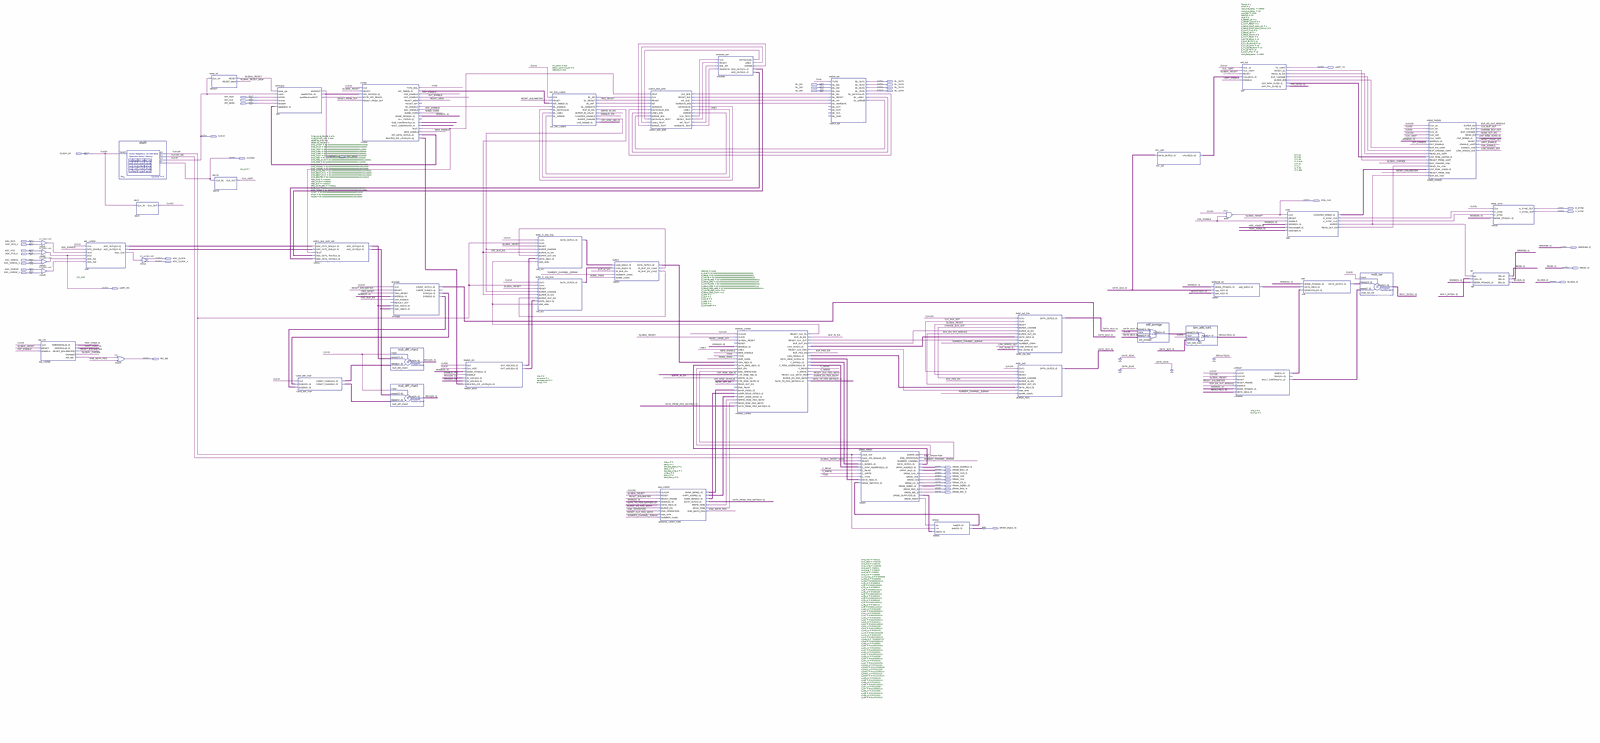
[diagram p0: schematic sheet, whole]
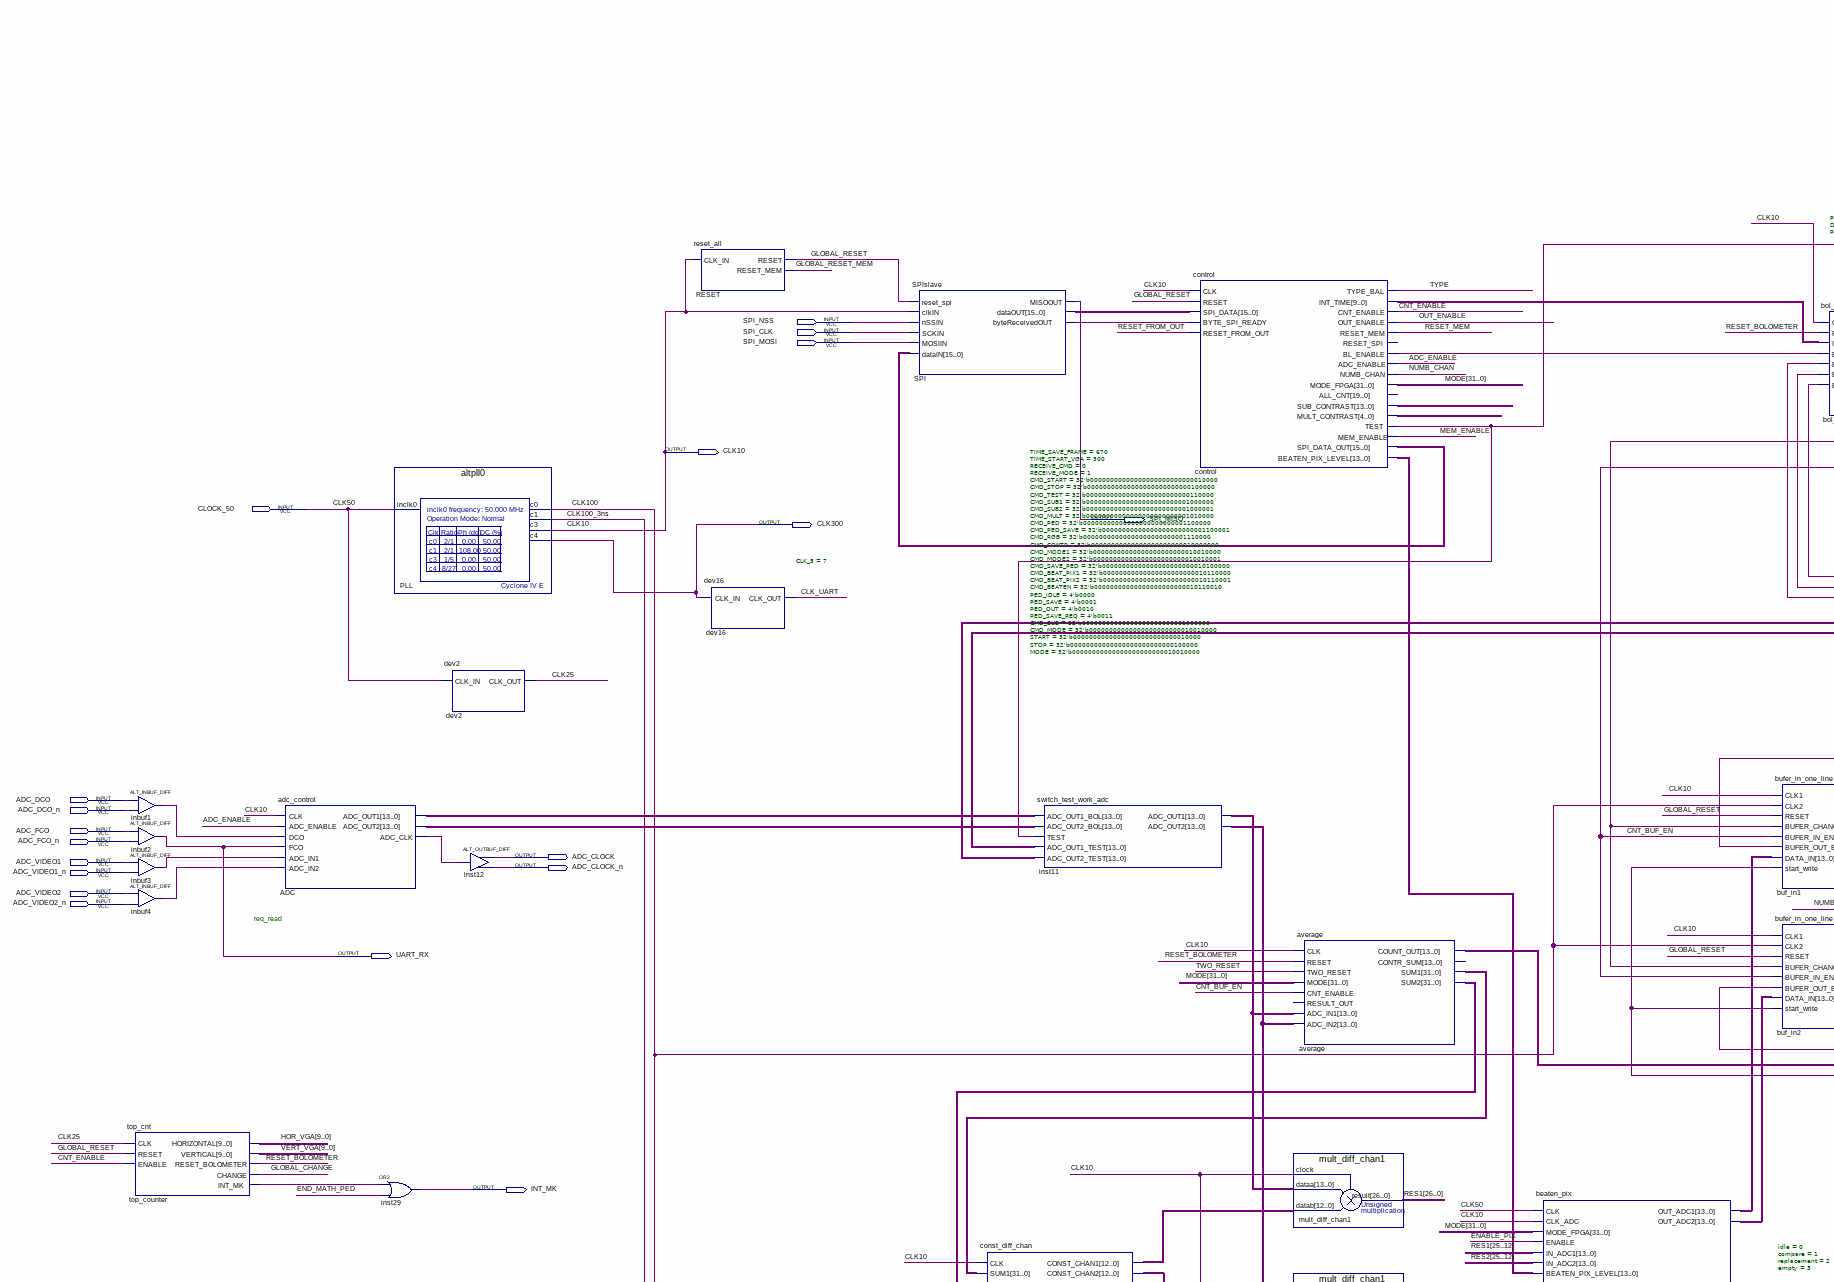
[diagram p1: schematic sheet, upper left part]
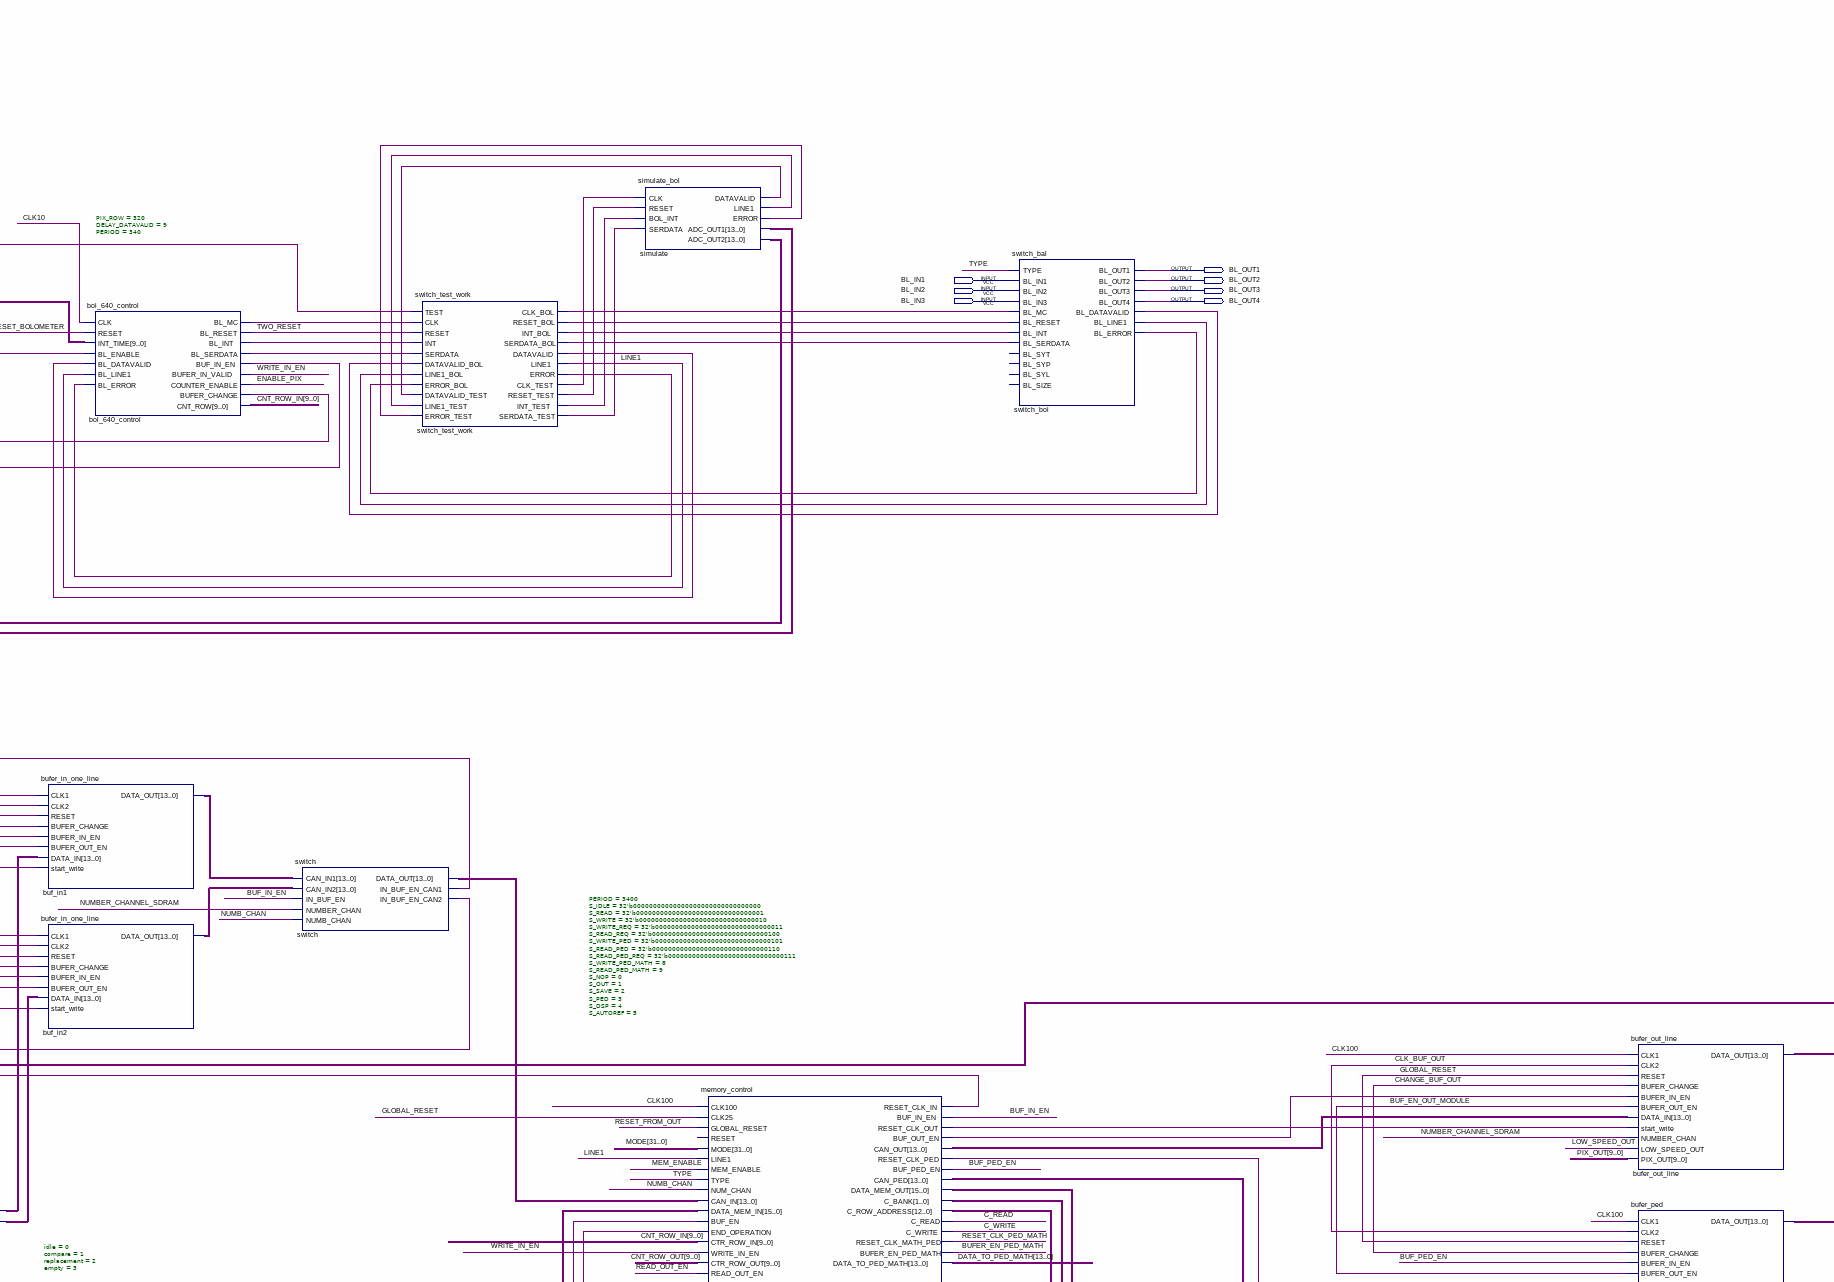
[diagram p2: schematic sheet, upper centre part]
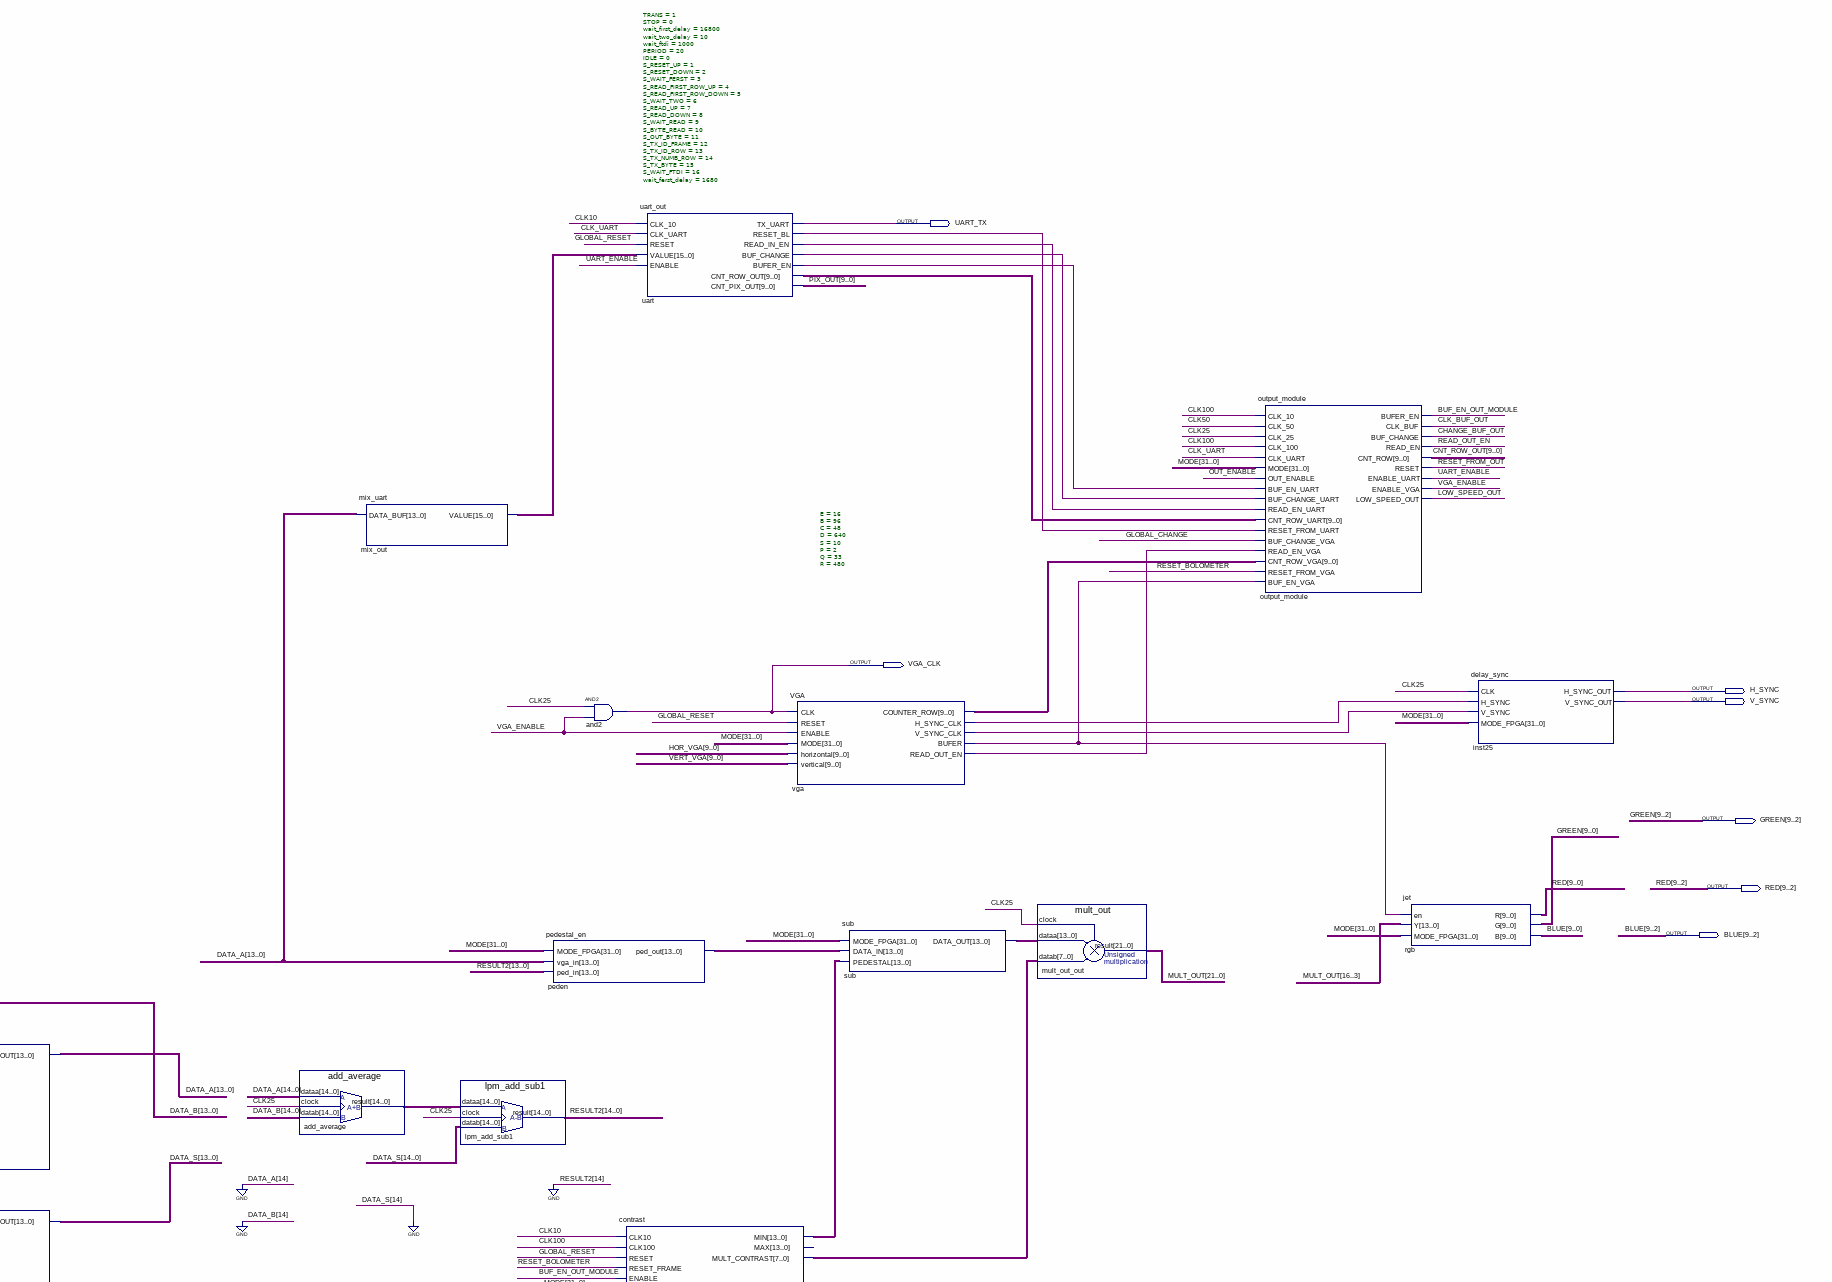
[diagram p3: schematic sheet, upper right part]
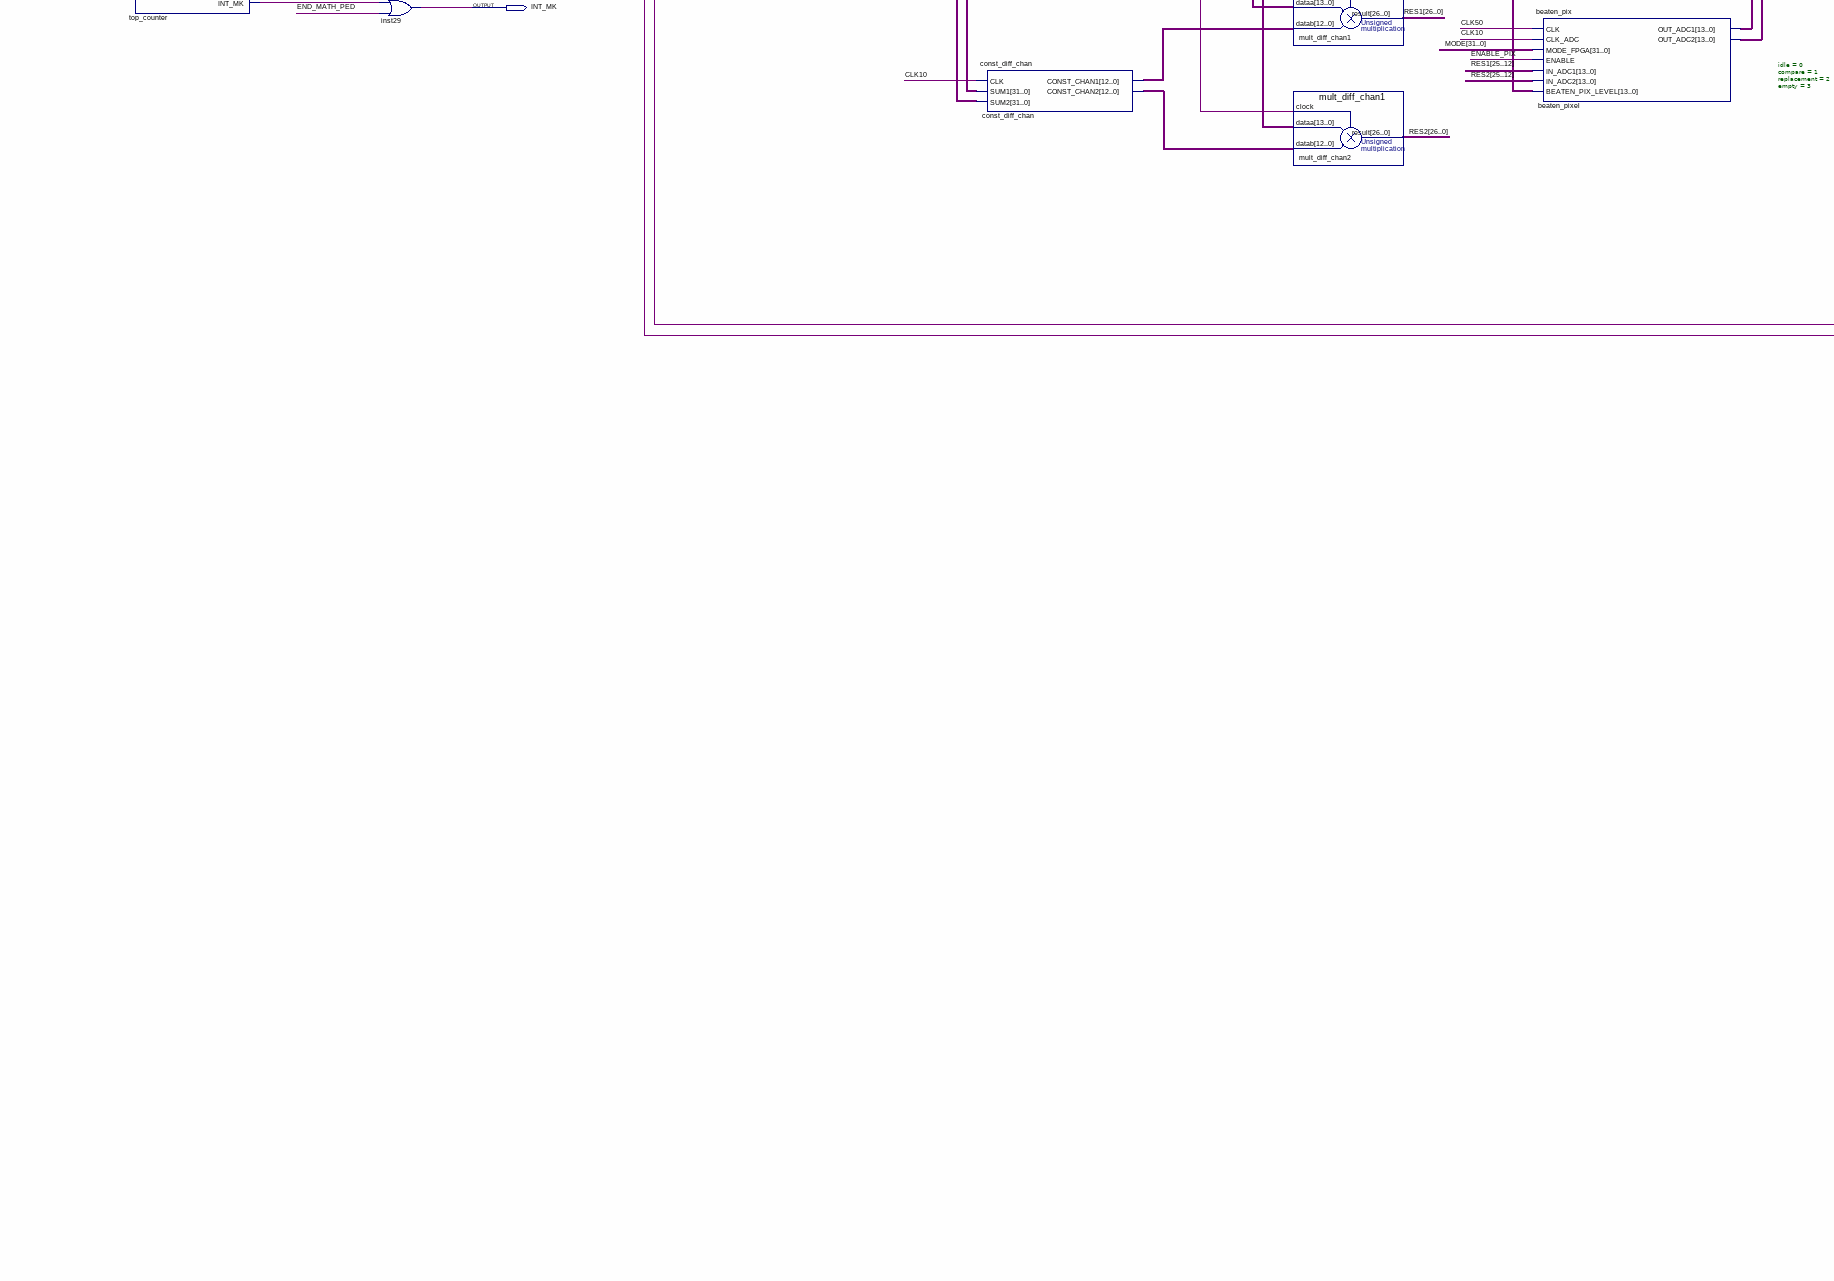
[diagram p4: schematic sheet, lower left part]
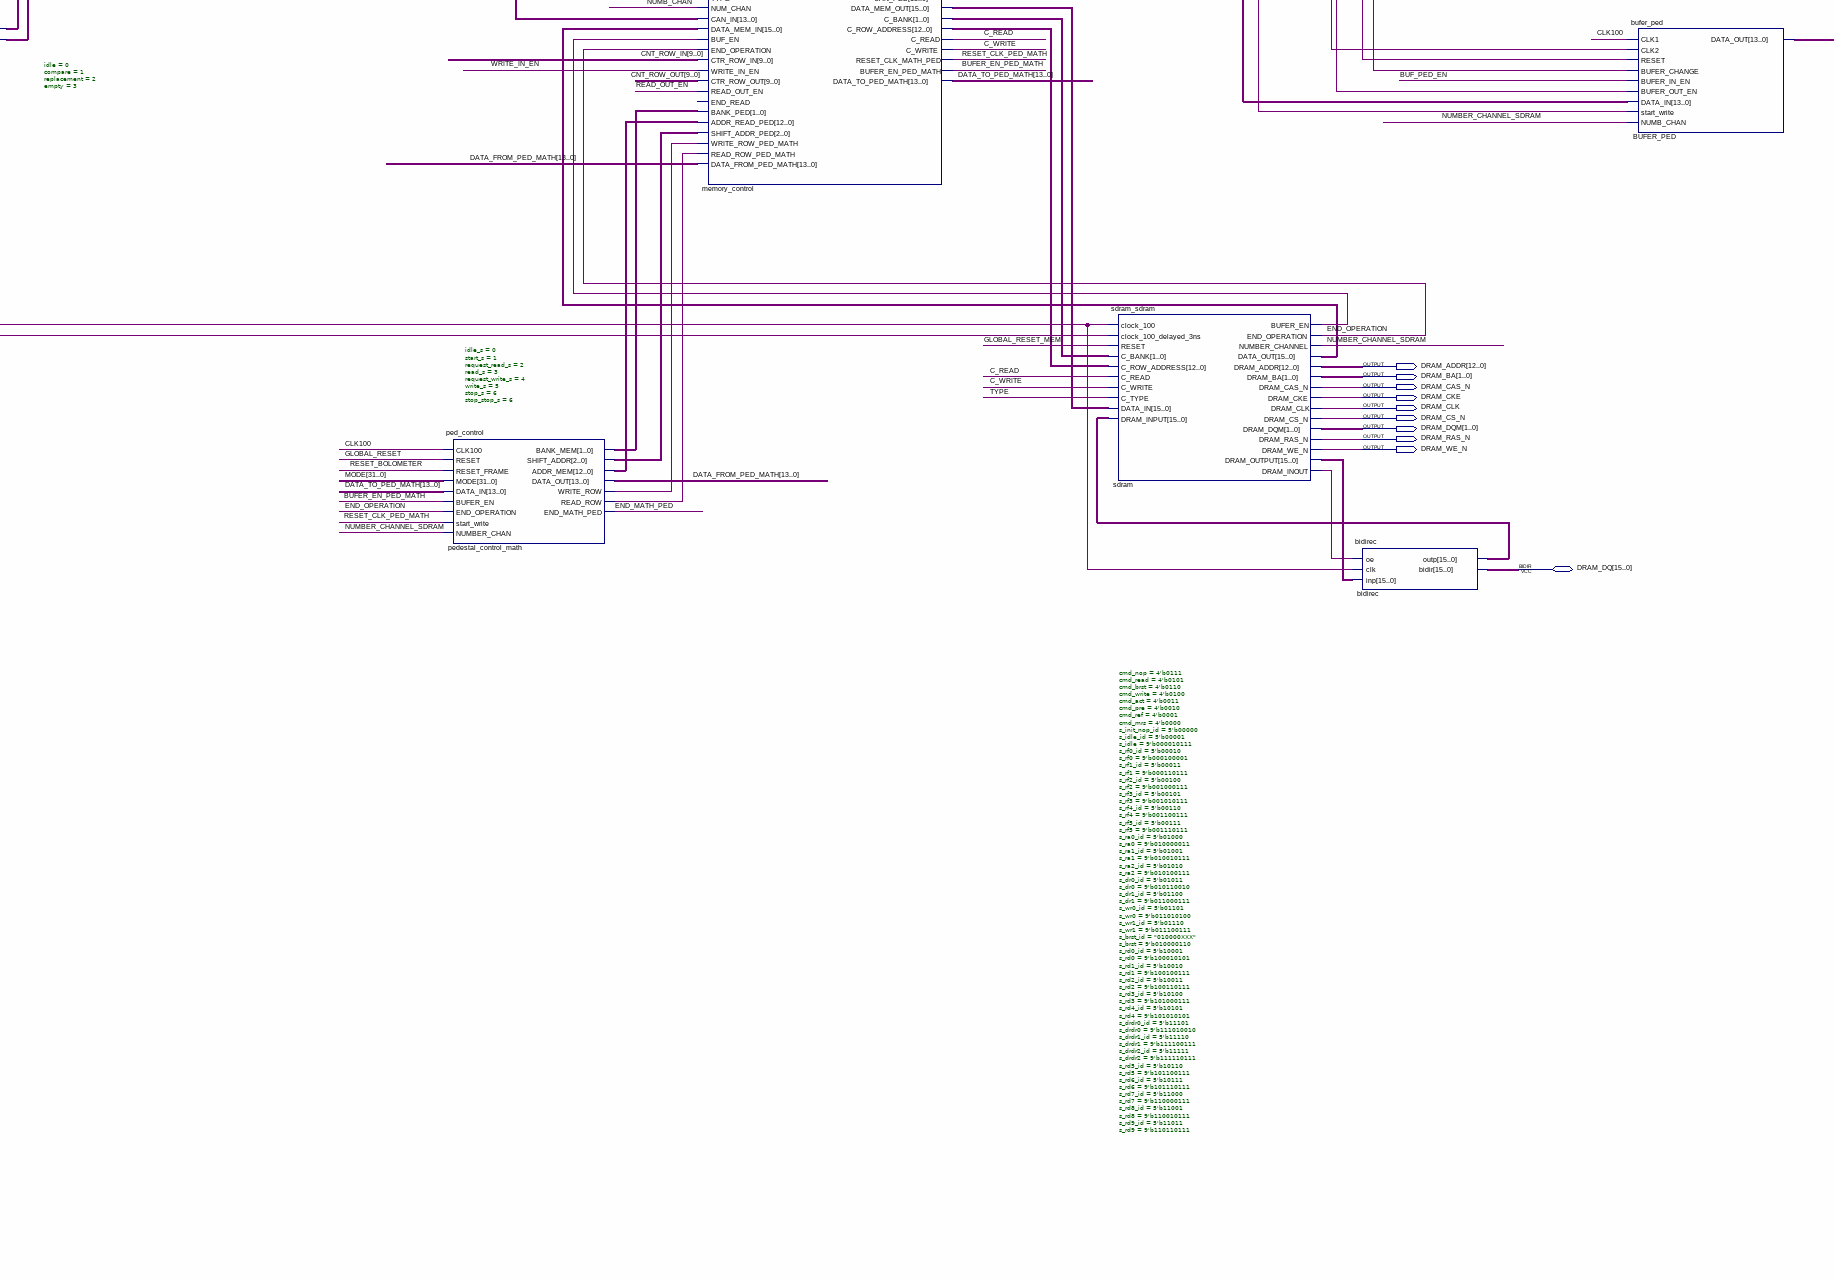
[diagram p5: schematic sheet, lower centre part]
// Quartus schematic Therm_sch.bdf as structural Verilog: 46 symbols, 43 pins
module Therm_sch (
  input  BL_IN1,
  input  BL_IN2,
  input  BL_IN3,
  input  SPI_NSS,
  input  SPI_CLK,
  input  SPI_MOSI,
  input  CLOCK_50,
  input  ADC_DCO,
  input  ADC_DCO_n,
  input  ADC_FCO,
  input  ADC_FCO_n,
  input  ADC_VIDEO1,
  input  ADC_VIDEO1_n,
  input  ADC_VIDEO2,
  input  ADC_VIDEO2_n,
  inout  [15:0] DRAM_DQ,
  output UART_TX,
  output BL_OUT1,
  output BL_OUT2,
  output BL_OUT3,
  output BL_OUT4,
  output CLK10,
  output SPI_MISO,
  output CLK300,
  output VGA_CLK,
  output H_SYNC,
  output V_SYNC,
  output [9:0] GREEN,
  output ADC_CLOCK,
  output ADC_CLOCK_n,
  output [9:0] RED,
  output [9:0] BLUE,
  output UART_RX,
  output INT_MK,
  output [12:0] DRAM_ADDR,
  output [1:0] DRAM_BA,
  output DRAM_CAS_N,
  output DRAM_CKE,
  output DRAM_CLK,
  output DRAM_CS_N,
  output [1:0] DRAM_DQM,
  output DRAM_RAS_N,
  output DRAM_WE_N
);

  wire ADC_adc_clk, ADC_ENABLE, bol_640_control_bl_int, bol_640_control_bl_mc, bol_640_control_bl_serdata,
       bol_640_control_bufer_change, BUF_EN_OUT_MODULE, BUF_IN_EN, BUF_PED_EN, BUFER_EN_PED_MATH, C_READ,
       C_WRITE, CHANGE_BUF_OUT, CLK25, CLK100, CLK100_3ns, CLK_BUF_OUT, CLK_UART, CNT_BUF_EN, CNT_ENABLE,
       control_bl_enable, control_test, ENABLE_PIX, END_MATH_PED, END_OPERATION, GLOBAL_CHANGE, GLOBAL_RESET,
       GLOBAL_RESET_MEM, inbuf1_o, inbuf3_o, inbuf4_o, LINE1, LOW_SPEED_OUT, MEM_ENABLE,
       memory_control_buf_out_en, memory_control_reset_clk_in, memory_control_reset_clk_out,
       memory_control_reset_clk_ped, NUMB_CHAN, NUMBER_CHANNEL_SDRAM, OUT_ENABLE,
       pedestal_control_math_read_row, pedestal_control_math_write_row, READ_OUT_EN, RESET_BOLOMETER,
       RESET_CLK_PED_MATH, RESET_FROM_OUT, RESET_MEM, sdram_bufer_en, sdram_dram_inout, simulate_datavalid,
       simulate_error, simulate_line1, SPI_bytereceivedout, switch_bol_bl_datavalid, switch_bol_bl_error,
       switch_bol_bl_line1, switch_in_buf_en_can1, switch_in_buf_en_can2, switch_test_work_clk_bol,
       switch_test_work_clk_test, switch_test_work_datavalid, switch_test_work_error,
       switch_test_work_int_bol, switch_test_work_int_test, switch_test_work_reset_bol,
       switch_test_work_reset_test, switch_test_work_serdata_bol, switch_test_work_serdata_test,
       top_counter_int_mk, TWO_RESET, TYPE, uart_buf_change, uart_bufer_en, UART_ENABLE, uart_read_in_en,
       uart_reset_bl, vga_bufer, VGA_ENABLE, vga_h_sync_clk, vga_read_out_en, vga_v_sync_clk, WRITE_IN_EN;
  wire [1:0] memory_control_c_bank, pedestal_control_math_bank_mem;
  wire [2:0] pedestal_control_math_shift_addr;
  wire [4:0] control_mult_contrast;
  wire [7:0] contrast_mult_contrast;
  wire [9:0] CNT_ROW_IN, CNT_ROW_OUT, control_int_time, HOR_VGA, PIX_OUT, uart_cnt_row_out, VERT_VGA,
       vga_counter_row;
  wire [12:0] const_diff_chan_const_chan1, const_diff_chan_const_chan2, memory_control_c_row_address,
       pedestal_control_math_addr_mem;
  wire [13:0] ADC_adc_out1, ADC_adc_out2, beaten_pixel_out_adc1, beaten_pixel_out_adc2, buf_in1_data_out,
       buf_in2_data_out, contrast_min, control_beaten_pix_level, control_sub_contrast, DATA_A, DATA_B,
       DATA_FROM_PED_MATH, DATA_S, DATA_TO_PED_MATH, inst11_adc_out1, inst11_adc_out2,
       memory_control_can_out, memory_control_can_ped, peden_ped_out, simulate_adc_out1, simulate_adc_out2,
       sub_data_out, switch_data_out;
  wire [14:0] add_average_result, RESULT2;
  wire [15:0] bidirec_outp, control_spi_data_out, memory_control_data_mem_out, mix_out_value, sdram_data_out,
       sdram_dram_output, SPI_dataout;
  wire [21:0] MULT_OUT;
  wire [26:0] RES1, RES2;
  wire [31:0] average_sum1, average_sum2, MODE;

  ALT_INBUF_DIFF inbuf1 (.i(ADC_DCO), .ibar(ADC_DCO_n), .o(inbuf1_o));
  ALT_INBUF_DIFF inbuf2 (.i(ADC_FCO), .ibar(ADC_FCO_n), .o(UART_RX));
  ALT_INBUF_DIFF inbuf3 (.i(ADC_VIDEO1), .ibar(ADC_VIDEO1_n), .o(inbuf3_o));
  ALT_INBUF_DIFF inbuf4 (.i(ADC_VIDEO2), .ibar(ADC_VIDEO2_n), .o(inbuf4_o));
  top_cnt top_counter (
    .CLK(CLK25), .RESET(GLOBAL_RESET), .ENABLE(CNT_ENABLE), .HORIZONTAL(HOR_VGA), .VERTICAL(VERT_VGA),
    .RESET_BOLOMETER(RESET_BOLOMETER), .CHANGE(GLOBAL_CHANGE), .INT_MK(top_counter_int_mk));
  adc_control ADC (
    .CLK(CLK10), .ADC_ENABLE(ADC_ENABLE), .DCO(inbuf1_o), .FCO(UART_RX), .ADC_IN1(inbuf3_o),
    .ADC_IN2(inbuf4_o), .ADC_OUT1(ADC_adc_out1), .ADC_OUT2(ADC_adc_out2), .ADC_CLK(ADC_adc_clk));
  altpll0 PLL (.inclk0(CLOCK_50), .c0(CLK100), .c1(CLK100_3ns), .c3(CLK10), .c4(CLK300));
  or inst29 (INT_MK, top_counter_int_mk, END_MATH_PED);
  dev2 dev2 (.CLK_IN(CLOCK_50), .CLK_OUT(CLK25));
  ALT_OUTBUF_DIFF inst12 (.i(ADC_adc_clk), .obar(ADC_CLOCK_n), .o(ADC_CLOCK));
  reset_all RESET (.CLK_IN(CLK10), .RESET(GLOBAL_RESET), .RESET_MEM(GLOBAL_RESET_MEM));
  dev16 #(.CLK_5(7)) dev16 (.CLK_IN(CLK300), .CLK_OUT(CLK_UART));
  SPIslave SPI (
    .reset_spi(GLOBAL_RESET), .clkIN(CLK10), .nSSIN(SPI_NSS), .SCKIN(SPI_CLK), .MOSIIN(SPI_MOSI),
    .dataIN(control_spi_data_out), .MISOOUT(SPI_MISO), .dataOUT(SPI_dataout),
    .byteReceivedOUT(SPI_bytereceivedout));
  const_diff_chan const_diff_chan (
    .CLK(CLK10), .SUM1(average_sum1), .SUM2(average_sum2), .CONST_CHAN1(const_diff_chan_const_chan1),
    .CONST_CHAN2(const_diff_chan_const_chan2));
  switch_test_work_adc inst11 (
    .ADC_OUT1_BOL(ADC_adc_out1), .ADC_OUT2_BOL(ADC_adc_out2), .TEST(control_test),
    .ADC_OUT1_TEST(simulate_adc_out1), .ADC_OUT2_TEST(simulate_adc_out2), .ADC_OUT1(inst11_adc_out1),
    .ADC_OUT2(inst11_adc_out2));
  control #(.TIME_SAVE_FRAME(670), .TIME_START_VGA(300), .RECEIVE_CMD(0), .RECEIVE_MODE(1), .CMD_START(32'b00000000000000000000000000010000), .CMD_STOP(32'b00000000000000000000000000100000), .CMD_TEST(32'b00000000000000000000000000110000), .CMD_SUB1(32'b00000000000000000000000001000000), .CMD_SUB2(32'b00000000000000000000000001000001), .CMD_MULT(32'b00000000000000000000000001010000), .CMD_PED(32'b00000000000000000000000001100000), .CMD_PED_SAVE(32'b00000000000000000000000001100001), .CMD_RGB(32'b00000000000000000000000001110000), .CMD_CONTR(32'b00000000000000000000000010000000), .CMD_MODE1(32'b00000000000000000000000010010000), .CMD_MODE2(32'b00000000000000000000000010010001), .CMD_SAVE_PED(32'b00000000000000000000000010100000), .CMD_BEAT_PIX1(32'b00000000000000000000000010110000), .CMD_BEAT_PIX2(32'b00000000000000000000000010110001), .CMD_BEATEN(32'b00000000000000000000000010110010), .PED_IDLE(4'b0000), .PED_SAVE(4'b0001), .PED_OUT(4'b0010), .PED_SAVE_REQ(4'b0011), .CMD_SUB(32'b00000000000000000000000001000000), .CMD_MODE(32'b00000000000000000000000010010000), .START(32'b00000000000000000000000000010000), .STOP(32'b00000000000000000000000000100000), .MODE(32'b00000000000000000000000010010000)) control (
    .CLK(CLK10), .RESET(GLOBAL_RESET), .SPI_DATA(SPI_dataout), .BYTE_SPI_READY(SPI_bytereceivedout),
    .RESET_FROM_OUT(RESET_FROM_OUT), .TYPE_BAL(TYPE), .INT_TIME(control_int_time), .CNT_ENABLE(CNT_ENABLE),
    .OUT_ENABLE(OUT_ENABLE), .RESET_MEM(RESET_MEM), .BL_ENABLE(control_bl_enable), .ADC_ENABLE(ADC_ENABLE),
    .NUMB_CHAN(NUMB_CHAN), .MODE_FPGA(MODE), .SUB_CONTRAST(control_sub_contrast),
    .MULT_CONTRAST(control_mult_contrast), .TEST(control_test), .MEM_ENABLE(MEM_ENABLE),
    .SPI_DATA_OUT(control_spi_data_out), .BEATEN_PIX_LEVEL(control_beaten_pix_level));  // open: RESET_SPI, ALL_CNT
  average average (
    .CLK(CLK10), .RESET(RESET_BOLOMETER), .TWO_RESET(TWO_RESET), .MODE(MODE), .CNT_ENABLE(CNT_BUF_EN),
    .ADC_IN1(inst11_adc_out1), .ADC_IN2(inst11_adc_out2), .COUNT_OUT(DATA_B), .SUM1(average_sum1),
    .SUM2(average_sum2));  // open: RESULT_OUT, CONTR_SUM
  mult_diff_chan1 mult_diff_chan1 (
    .clock(CLK10), .dataa(inst11_adc_out1), .datab(const_diff_chan_const_chan1), .result(RES1));
  mult_diff_chan1 mult_diff_chan2 (
    .clock(CLK10), .dataa(inst11_adc_out2), .datab(const_diff_chan_const_chan2), .result(RES2));
  beaten_pix #(.idle(0), .compare(1), .replacement(2), .empty(3)) beaten_pixel (
    .CLK(CLOCK_50), .CLK_ADC(CLK10), .MODE_FPGA(MODE), .ENABLE(ENABLE_PIX), .IN_ADC1(RES1[25:12]),
    .IN_ADC2(RES2[25:12]), .BEATEN_PIX_LEVEL(control_beaten_pix_level), .OUT_ADC1(beaten_pixel_out_adc1),
    .OUT_ADC2(beaten_pixel_out_adc2));
  bufer_in_one_line buf_in1 (
    .CLK1(CLK10), .CLK2(CLK100), .RESET(GLOBAL_RESET), .BUFER_CHANGE(bol_640_control_bufer_change),
    .BUFER_IN_EN(CNT_BUF_EN), .BUFER_OUT_EN(switch_in_buf_en_can1), .DATA_IN(beaten_pixel_out_adc1),
    .start_write(memory_control_reset_clk_in), .DATA_OUT(buf_in1_data_out));
  bufer_in_one_line buf_in2 (
    .CLK1(CLK10), .CLK2(CLK100), .RESET(GLOBAL_RESET), .BUFER_CHANGE(bol_640_control_bufer_change),
    .BUFER_IN_EN(CNT_BUF_EN), .BUFER_OUT_EN(switch_in_buf_en_can2), .DATA_IN(beaten_pixel_out_adc2),
    .start_write(memory_control_reset_clk_in), .DATA_OUT(buf_in2_data_out));
  bol_640_control #(.PIX_ROW(320), .DELAY_DATAVALID(9), .PERIOD(340)) bol_640_control (
    .CLK(CLK10), .RESET(RESET_BOLOMETER), .INT_TIME(control_int_time), .BL_ENABLE(control_bl_enable),
    .BL_DATAVALID(switch_test_work_datavalid), .BL_LINE1(LINE1), .BL_ERROR(switch_test_work_error),
    .BL_MC(bol_640_control_bl_mc), .BL_RESET(TWO_RESET), .BL_INT(bol_640_control_bl_int),
    .BL_SERDATA(bol_640_control_bl_serdata), .BUF_IN_EN(CNT_BUF_EN), .BUFER_IN_VALID(WRITE_IN_EN),
    .COUNTER_ENABLE(ENABLE_PIX), .BUFER_CHANGE(bol_640_control_bufer_change), .CNT_ROW(CNT_ROW_IN));
  switch switch (
    .CAN_IN1(buf_in1_data_out), .CAN_IN2(buf_in2_data_out), .IN_BUF_EN(BUF_IN_EN),
    .NUMBER_CHAN(NUMBER_CHANNEL_SDRAM), .NUMB_CHAN(NUMB_CHAN), .DATA_OUT(switch_data_out),
    .IN_BUF_EN_CAN1(switch_in_buf_en_can1), .IN_BUF_EN_CAN2(switch_in_buf_en_can2));
  switch_test_work switch_test_work (
    .TEST(control_test), .CLK(bol_640_control_bl_mc), .RESET(TWO_RESET), .INT(bol_640_control_bl_int),
    .SERDATA(bol_640_control_bl_serdata), .DATAVALID_BOL(switch_bol_bl_datavalid),
    .LINE1_BOL(switch_bol_bl_line1), .ERROR_BOL(switch_bol_bl_error), .DATAVALID_TEST(simulate_datavalid),
    .LINE1_TEST(simulate_line1), .ERROR_TEST(simulate_error), .CLK_BOL(switch_test_work_clk_bol),
    .RESET_BOL(switch_test_work_reset_bol), .INT_BOL(switch_test_work_int_bol),
    .SERDATA_BOL(switch_test_work_serdata_bol), .DATAVALID(switch_test_work_datavalid), .LINE1(LINE1),
    .ERROR(switch_test_work_error), .CLK_TEST(switch_test_work_clk_test),
    .RESET_TEST(switch_test_work_reset_test), .INT_TEST(switch_test_work_int_test),
    .SERDATA_TEST(switch_test_work_serdata_test));
  ped_control #(.idle_s(0), .start_s(1), .request_read_s(2), .read_s(3), .request_write_s(4), .write_s(5), .stop_s(6), .stop_stop_s(6)) pedestal_control_math (
    .CLK100(CLK100), .RESET(GLOBAL_RESET), .RESET_FRAME(RESET_BOLOMETER), .MODE(MODE),
    .DATA_IN(DATA_TO_PED_MATH), .BUFER_EN(BUFER_EN_PED_MATH), .END_OPERATION(END_OPERATION),
    .start_write(RESET_CLK_PED_MATH), .NUMBER_CHAN(NUMBER_CHANNEL_SDRAM),
    .BANK_MEM(pedestal_control_math_bank_mem), .SHIFT_ADDR(pedestal_control_math_shift_addr),
    .ADDR_MEM(pedestal_control_math_addr_mem), .DATA_OUT(DATA_FROM_PED_MATH),
    .WRITE_ROW(pedestal_control_math_write_row), .READ_ROW(pedestal_control_math_read_row),
    .END_MATH_PED(END_MATH_PED));
  simulate_bol simulate (
    .CLK(switch_test_work_clk_test), .RESET(switch_test_work_reset_test),
    .BOL_INT(switch_test_work_int_test), .SERDATA(switch_test_work_serdata_test),
    .DATAVALID(simulate_datavalid), .LINE1(simulate_line1), .ERROR(simulate_error),
    .ADC_OUT1(simulate_adc_out1), .ADC_OUT2(simulate_adc_out2));
  memory_control #(.PERIOD(3400), .S_IDLE(32'b00000000000000000000000000000000), .S_READ(32'b00000000000000000000000000000001), .S_WRITE(32'b00000000000000000000000000000010), .S_WRITE_REQ(32'b00000000000000000000000000000011), .S_READ_REQ(32'b00000000000000000000000000000100), .S_WRITE_PED(32'b00000000000000000000000000000101), .S_READ_PED(32'b00000000000000000000000000000110), .S_READ_PED_REQ(32'b00000000000000000000000000000111), .S_WRITE_PED_MATH(8), .S_READ_PED_MATH(9), .S_NOP(0), .S_OUT(1), .S_SAVE(2), .S_PED(3), .S_DSP(4), .S_AUTOREF(5)) memory_control (
    .CLK100(CLK100), .CLK25(GLOBAL_RESET), .GLOBAL_RESET(RESET_FROM_OUT), .MODE(MODE), .LINE1(LINE1),
    .MEM_ENABLE(MEM_ENABLE), .TYPE(TYPE), .NUM_CHAN(NUMB_CHAN), .CAN_IN(switch_data_out),
    .DATA_MEM_IN(sdram_data_out), .BUF_EN(sdram_bufer_en), .END_OPERATION(END_OPERATION),
    .CTR_ROW_IN(CNT_ROW_IN), .WRITE_IN_EN(WRITE_IN_EN), .CTR_ROW_OUT(CNT_ROW_OUT), .READ_OUT_EN(READ_OUT_EN),
    .BANK_PED(pedestal_control_math_bank_mem), .ADDR_READ_PED(pedestal_control_math_addr_mem),
    .SHIFT_ADDR_PED(pedestal_control_math_shift_addr), .WRITE_ROW_PED_MATH(pedestal_control_math_write_row),
    .READ_ROW_PED_MATH(pedestal_control_math_read_row), .DATA_FROM_PED_MATH(DATA_FROM_PED_MATH),
    .RESET_CLK_IN(memory_control_reset_clk_in), .BUF_IN_EN(BUF_IN_EN),
    .RESET_CLK_OUT(memory_control_reset_clk_out), .BUF_OUT_EN(memory_control_buf_out_en),
    .CAN_OUT(memory_control_can_out), .RESET_CLK_PED(memory_control_reset_clk_ped), .BUF_PED_EN(BUF_PED_EN),
    .CAN_PED(memory_control_can_ped), .DATA_MEM_OUT(memory_control_data_mem_out),
    .C_BANK(memory_control_c_bank), .C_ROW_ADDRESS(memory_control_c_row_address), .C_READ(C_READ),
    .C_WRITE(C_WRITE), .RESET_CLK_MATH_PED(RESET_CLK_PED_MATH), .BUFER_EN_PED_MATH(BUFER_EN_PED_MATH),
    .DATA_TO_PED_MATH(DATA_TO_PED_MATH));  // open: RESET, END_READ
  switch_bal switch_bol (
    .TYPE(TYPE), .BL_IN1(BL_IN1), .BL_IN2(BL_IN2), .BL_IN3(BL_IN3), .BL_MC(switch_test_work_clk_bol),
    .BL_RESET(switch_test_work_reset_bol), .BL_INT(switch_test_work_int_bol),
    .BL_SERDATA(switch_test_work_serdata_bol), .BL_OUT1(BL_OUT1), .BL_OUT2(BL_OUT2), .BL_OUT3(BL_OUT3),
    .BL_OUT4(BL_OUT4), .BL_DATAVALID(switch_bol_bl_datavalid), .BL_LINE1(switch_bol_bl_line1),
    .BL_ERROR(switch_bol_bl_error));  // open: BL_SYT, BL_SYP, BL_SYL, BL_SIZE
  sdram_sdram #(.cmd_nop(4'b0111), .cmd_read(4'b0101), .cmd_brst(4'b0110), .cmd_write(4'b0100), .cmd_act(4'b0011), .cmd_pre(4'b0010), .cmd_ref(4'b0001), .cmd_mrs(4'b0000), .s_init_nop_id(5'b00000), .s_idle_id(5'b00001), .s_idle(9'b000010111), .s_rf0_id(5'b00010), .s_rf0(9'b000100001), .s_rf1_id(5'b00011), .s_rf1(9'b000110111), .s_rf2_id(5'b00100), .s_rf2(9'b001000111), .s_rf3_id(5'b00101), .s_rf3(9'b001010111), .s_rf4_id(5'b00110), .s_rf4(9'b001100111), .s_rf5_id(5'b00111), .s_rf5(9'b001110111), .s_ra0_id(5'b01000), .s_ra0(9'b010000011), .s_ra1_id(5'b01001), .s_ra1(9'b010010111), .s_ra2_id(5'b01010), .s_ra2(9'b010100111), .s_dr0_id(5'b01011), .s_dr0(9'b010110010), .s_dr1_id(5'b01100), .s_dr1(9'b011000111), .s_wr0_id(5'b01101), .s_wr0(9'b011010100), .s_wr1_id(5'b01110), .s_wr1(9'b011100111), .s_brst_id("010000XXX"), .s_brst(9'b010000110), .s_rd0_id(5'b10001), .s_rd0(9'b100010101), .s_rd1_id(5'b10010), .s_rd1(9'b100100111), .s_rd2_id(5'b10011), .s_rd2(9'b100110111), .s_rd3_id(5'b10100), .s_rd3(9'b101000111), .s_rd4_id(5'b10101), .s_rd4(9'b101010101), .s_drdr0_id(5'b11101), .s_drdr0(9'b111010010), .s_drdr1_id(5'b11110), .s_drdr1(9'b111100111), .s_drdr2_id(5'b11111), .s_drdr2(9'b111110111), .s_rd5_id(5'b10110), .s_rd5(9'b101100111), .s_rd6_id(5'b10111), .s_rd6(9'b101110111), .s_rd7_id(5'b11000), .s_rd7(9'b110000111), .s_rd8_id(5'b11001), .s_rd8(9'b110010111), .s_rd9_id(5'b11011), .s_rd9(9'b110110111)) sdram (
    .clock_100(CLK100), .clock_100_delayed_3ns(CLK100_3ns), .RESET(GLOBAL_RESET_MEM),
    .C_BANK(memory_control_c_bank), .C_ROW_ADDRESS(memory_control_c_row_address), .C_READ(C_READ),
    .C_WRITE(C_WRITE), .C_TYPE(TYPE), .DATA_IN(memory_control_data_mem_out), .DRAM_INPUT(bidirec_outp),
    .BUFER_EN(sdram_bufer_en), .END_OPERATION(END_OPERATION), .NUMBER_CHANNEL(NUMBER_CHANNEL_SDRAM),
    .DATA_OUT(sdram_data_out), .DRAM_ADDR(DRAM_ADDR), .DRAM_BA(DRAM_BA), .DRAM_CAS_N(DRAM_CAS_N),
    .DRAM_CKE(DRAM_CKE), .DRAM_CLK(DRAM_CLK), .DRAM_CS_N(DRAM_CS_N), .DRAM_DQM(DRAM_DQM),
    .DRAM_RAS_N(DRAM_RAS_N), .DRAM_WE_N(DRAM_WE_N), .DRAM_OUTPUT(sdram_dram_output),
    .DRAM_INOUT(sdram_dram_inout));
  bidirec bidirec (.oe(sdram_dram_inout), .clk(CLK100), .inp(sdram_dram_output), .outp(bidirec_outp), .bidir(DRAM_DQ));
  bufer_out_line bufer_out_line (
    .CLK1(CLK100), .CLK2(CLK_BUF_OUT), .RESET(GLOBAL_RESET), .BUFER_CHANGE(CHANGE_BUF_OUT),
    .BUFER_IN_EN(memory_control_buf_out_en), .BUFER_OUT_EN(BUF_EN_OUT_MODULE),
    .DATA_IN(memory_control_can_out), .start_write(memory_control_reset_clk_out),
    .NUMBER_CHAN(NUMBER_CHANNEL_SDRAM), .LOW_SPEED_OUT(LOW_SPEED_OUT), .PIX_OUT(PIX_OUT), .DATA_OUT(DATA_A));
  bufer_ped BUFER_PED (
    .CLK1(CLK100), .CLK2(CLK_BUF_OUT), .RESET(GLOBAL_RESET), .BUFER_CHANGE(CHANGE_BUF_OUT),
    .BUFER_IN_EN(BUF_PED_EN), .BUFER_OUT_EN(BUF_EN_OUT_MODULE), .DATA_IN(memory_control_can_ped),
    .start_write(memory_control_reset_clk_ped), .NUMB_CHAN(NUMBER_CHANNEL_SDRAM), .DATA_OUT(DATA_S));
  add_average add_average (.dataa({1'b0, DATA_A}), .datab({1'b0, DATA_B}), .clock(CLK25), .result(add_average_result));
  mix_uart mix_out (.DATA_BUF(DATA_A), .VALUE(mix_out_value));
  lpm_add_sub1 lpm_add_sub1 (.dataa(add_average_result), .datab({1'b0, DATA_S}), .clock(CLK25), .result(RESULT2));
  pedestal_en peden (.MODE_FPGA(MODE), .vga_in(DATA_A), .ped_in(RESULT2[13:0]), .ped_out(peden_ped_out));
  and and2 (VGA_CLK, CLK25, VGA_ENABLE);
  contrast #(.idle_s(0), .count_s(1)) contrast (
    .CLK10(CLK10), .CLK100(CLK100), .RESET(GLOBAL_RESET), .RESET_FRAME(RESET_BOLOMETER),
    .ENABLE(BUF_EN_OUT_MODULE), .MODE_FPGA(MODE), .DATA_IN(RESULT2[13:0]), .MIN(contrast_min),
    .MULT_CONTRAST(contrast_mult_contrast));  // open: MAX
  uart_out #(.TRANS(1), .STOP(0), .wait_first_delay(16800), .wait_two_delay(10), .wait_ftdi(1000), .PERIOD(20), .IDLE(0), .S_RESET_UP(1), .S_RESET_DOWN(2), .S_WAIT_FERST(3), .S_READ_FIRST_ROW_UP(4), .S_READ_FIRST_ROW_DOWN(5), .S_WAIT_TWO(6), .S_READ_UP(7), .S_READ_DOWN(8), .S_WAIT_READ(9), .S_BYTE_READ(10), .S_OUT_BYTE(11), .S_TX_ID_FRAME(12), .S_TX_ID_ROW(13), .S_TX_NUMB_ROW(14), .S_TX_BYTE(15), .S_WAIT_FTDI(16), .wait_ferst_delay(1680)) uart (
    .CLK_10(CLK10), .CLK_UART(CLK_UART), .RESET(GLOBAL_RESET), .VALUE(mix_out_value), .ENABLE(UART_ENABLE),
    .TX_UART(UART_TX), .RESET_BL(uart_reset_bl), .READ_IN_EN(uart_read_in_en), .BUF_CHANGE(uart_buf_change),
    .BUFER_EN(uart_bufer_en), .CNT_ROW_OUT(uart_cnt_row_out), .CNT_PIX_OUT(PIX_OUT));
  VGA #(.E(16), .B(96), .C(48), .D(640), .S(10), .P(2), .Q(33), .R(480)) vga (
    .CLK(VGA_CLK), .RESET(GLOBAL_RESET), .ENABLE(VGA_ENABLE), .MODE(MODE), .horizontal(HOR_VGA),
    .vertical(VERT_VGA), .COUNTER_ROW(vga_counter_row), .H_SYNC_CLK(vga_h_sync_clk),
    .V_SYNC_CLK(vga_v_sync_clk), .BUFER(vga_bufer), .READ_OUT_EN(vga_read_out_en));
  sub sub (.MODE_FPGA(MODE), .DATA_IN(peden_ped_out), .PEDESTAL(contrast_min), .DATA_OUT(sub_data_out));
  mult_out mult_out_out (.clock(CLK25), .dataa(sub_data_out), .datab(contrast_mult_contrast), .result(MULT_OUT));
  output_module output_module (
    .CLK_10(CLK100), .CLK_50(CLOCK_50), .CLK_25(CLK25), .CLK_100(CLK100), .CLK_UART(CLK_UART), .MODE(MODE),
    .OUT_ENABLE(OUT_ENABLE), .BUF_EN_UART(uart_bufer_en), .BUF_CHANGE_UART(uart_buf_change),
    .READ_EN_UART(uart_read_in_en), .CNT_ROW_UART(uart_cnt_row_out), .RESET_FROM_UART(uart_reset_bl),
    .BUF_CHANGE_VGA(GLOBAL_CHANGE), .READ_EN_VGA(vga_read_out_en), .CNT_ROW_VGA(vga_counter_row),
    .RESET_FROM_VGA(RESET_BOLOMETER), .BUF_EN_VGA(vga_bufer), .BUFER_EN(BUF_EN_OUT_MODULE),
    .CLK_BUF(CLK_BUF_OUT), .BUF_CHANGE(CHANGE_BUF_OUT), .READ_EN(READ_OUT_EN), .CNT_ROW(CNT_ROW_OUT),
    .RESET(RESET_FROM_OUT), .ENABLE_UART(UART_ENABLE), .ENABLE_VGA(VGA_ENABLE), .LOW_SPEED_OUT(LOW_SPEED_OUT));
  jet rgb (.en(vga_bufer), .Y(MULT_OUT[16:3]), .MODE_FPGA(MODE), .R(RED), .G(GREEN), .B(BLUE));
  delay_sync inst25 (
    .CLK(CLK25), .H_SYNC(vga_h_sync_clk), .V_SYNC(vga_v_sync_clk), .MODE_FPGA(MODE), .H_SYNC_OUT(H_SYNC),
    .V_SYNC_OUT(V_SYNC));
  // also tied to GND on the sheet: RESULT2[14]

  // Other names for the same wires on the sheet: CLK50 = CLOCK_50

  // Notes on the sheet:
  //   req_read
endmodule
